# Altium schematic sheet STM32WL_RF.SchDoc
size A4; SheetNumber: 2; SheetTotal: 5
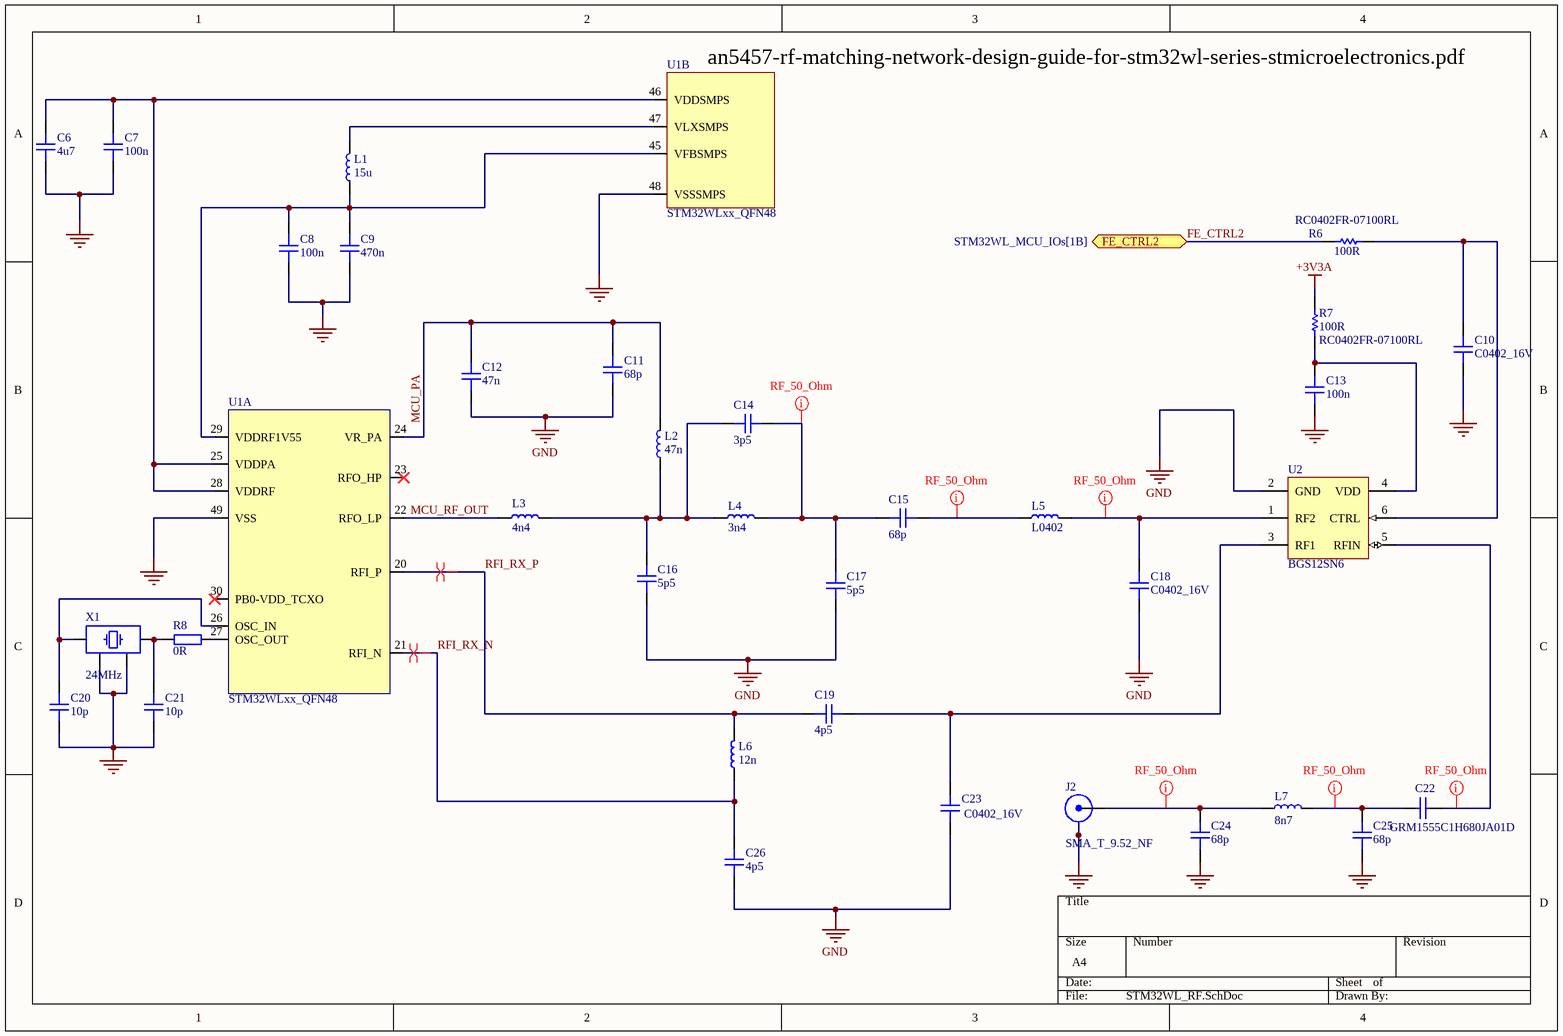
[diagram p0: STM32WL_RF.SchDoc]

## Parts
C6  4u7  [CAP_0603]
C7  100n  [CAP_0603]
C8  100n  [CAP_0603]
C9  470n  [CAP_0603]
C10  C0402_16V  [CAP_0402]
C11  68p  [CAP_0402]
C12  47n  [CAP_0402]
C13  100n  [CAP_0402]
C14  3p5  [CAP_0402]
C15  68p  [CAP_0402]
C16  5p5  [CAP_0402]
C17  5p5  [CAP_0402]
C18  C0402_16V  [CAP_0402]
C19  4p5  [CAP_0402]
C20  10p  [CAP_0402]
C21  10p  [CAP_0402]
C22  GRM1555C1H680JA01D  [CAPC1005X55X25LL05T10]
C23  C0402_16V  [CAP_0402]
C24  68p  [CAP_0402]
C25  68p  [CAP_0402]
C26  4p5  [CAP_0402]
J2  SMA_T_9.52_NF  [CO_SAMTEC_SMA-J-P-ST-EMI]
L1  15u  [IND_0402]
L2  47n  [IND_0402]
L3  4n4  [IND_0402]
L4  3n4  [IND_0402]
L5  L0402  [IND_0402]
L6  12n  [IND_0402]
L7  8n7  [IND_0402]
R6  value 100R  Manufacturer_Part_Number: RC0402FR-07100RL  [R0402]
R7  value 100R  Manufacturer_Part_Number: RC0402FR-07100RL  [R0402]
R8  0R  [RES_0402]
U1  STM32WLxx_QFN48  [STM32WLxx_QFN48]  (parts A,B of 5)
U2  BGS12SN6  [INF-TSNP-6-2_V]
X1  24MHz  [XTAL_3225]

## Ports
FE_CTRL2 (bidir, see STM32WL_MCU_IOs[1B])

## Nets
+3V3A: R7.2
GND: C6.1 C7.1 C8.1 C9.1 C10.1 C11.1 C12.1 C13.1 C16.1 C17.1 C18.1 C20.1 C21.1 C23.1 C24.1 C25.1 C26.1 J2.2(Y) U1.48(VSSSMPS) U1.49(VSS) U2.2(GND) X1.2 X1.4
FE_CTRL2: R6.1 ; port FE_CTRL2
MCU_PA: C11.2 C12.2 L2.2 U1.24(VR_PA)
MCU_RF_OUT: L3.1 U1.22(RFO_LP)
RFI_RX_N: C26.2 L6.1 U1.21(RFI_N)
RFI_RX_P: C19.1 L6.2 U1.20(RFI_P)
NetC6_2: C6.2 C7.2 U1.25(VDDPA) U1.28(VDDRF) U1.46(VDDSMPS)
NetC8_2: C8.2 C9.2 L1.1 U1.29(VDDRF1V55) U1.45(VFBSMPS)
NetC10_2: C10.2 R6.2 U2.6(CTRL)
NetC13_2: C13.2 R7.1 U2.4(VDD)
NetC14_1: C14.1 C16.2 L2.1 L3.2 L4.1
NetC14_2: C14.2 C15.1 C17.2 L4.2
NetC15_2: C15.2 L5.1
NetC18_2: C18.2 L5.2 U2.1(RF2)
NetC19_2: C19.2 C23.2 U2.3(RF1)
NetC20_2: C20.2 U1.26(OSC_IN) X1.1
NetC21_2: C21.2 R8.1 X1.3
NetC22_1: C22.1 C25.2 L7.2
NetC22_2: C22.2 U2.5(RFIN)
NetC24_2: C24.2 J2.1(X) L7.1
NetL1_2: L1.2 U1.47(VLXSMPS)
NetR8_2: R8.2 U1.27(OSC_OUT)

Not connected (* = marked no-connect by the designer): U1 23(RFO_HP)* 30(PB0-VDD_TCXO)*

## Layout directives
net class RF_50_Ohm: NetC14_2, NetC15_2, NetC18_2, NetC22_1, NetC22_2, NetC24_2
differential pair: RFI_RX_N, RFI_RX_P

## Notes on the sheet
- (near U1) an5457-rf-matching-network-design-guide-for-stm32wl-series-stmicroelectronics.pdf

## Library data of the parts
C6-C9 = CAP_0201_16V: Capacitor SMD 0201 16V
C10-C21 C23-C25 = CAP_0402_16V: Capacitor SMD 0402 16V
C22 = CMP-2008-04406-1: Manufacturer: Murata; Part Number: GRM1555C1H680JA01D
C26 = CAP_0402_16V
J2 = SMA_T_9.52_NF: SMA End Launch Jack 1.0 mm Board, 50 ohm; Manufacturer: COAX CONNECTORS LTD; Manufacturer_Part_Number: 30-462-D3-1.1mm
L1 L2 L4-L7 = IND_0402: Inductor SMD 0402
L3 = IND_0402: Inductor SMD 0402 LQW15AN4N4G80D
R6 R7 = MCD-00119: Resistor,100R,0402,1%,1/16W; Manufacturer: YAGEO; Provided_By: SUBCO; ECCN_US: EAR99; ECCN_EU: NEC; Internal_Part_Number: MCD-00119; Status: Released; Part_Type: Resistor; Package: R0402; ComponentLink1Description: Datasheet; ComponentLink1URL: http://tunmcdsvn.tun.st.com/Component_Datasheet_Library/Trunk/Resistors/Yageo_Resistor_RC0402-series
R8 = RES_0402: Resistor SMD 0402
U1 = STM32WLxx_QFN48: HQDC : Verified April, 25 2019; Manufacturer: STMicroelectronics; Manufacturer_Part_Number: STM32WLE5CC
U2 = CMP-1088-00016-1: Wideband RF SPDT Switch, 0.1 to 6 GHz, TSNP-6, Reel, Green; Manufacturer: Infineon; Green: TRUE; Supply Voltage Range: 1.8 - 3.5; Packing: Tape and Reel; Isolation @1GHz: 40 dB; Insertion Loss @1GHz: 0.25 dB; Pmax: 30 dBm; ComponentLink2URL: http://www.infineon.com/dgdl/BGS12SN6_2014-05-23.pdf?folderId=db3a30431f848401011fcbf2ab4c04c4&fileId=db3a30433f1b26e8013f2db58bc03856; PackageReference: TSNP-6-2; PartNumber: BGS12SN6; DatasheetVersion: Rev. 1.2; ComponentLink3URL: http://www.infineon.com/dgdl/TSNP-6-2-Package_Overview.pdf?folderId=db3a304327b89750012805e1379a6124&fileId=db3a30433c6612b1013c6bcb02293ba1; ComponentLink2Description: Datasheet; PackageDescription: 6-Pin Thin Small Non Leaded Package, 1.1 x 0.7 mm Body, 0.4 mm Pitch; ComponentLink1URL: http://www.infineon.com/; Frequency ( f ) Range: 0.1 to 6 GHz; Switch Type: SPDT; Mounting Technology: Surface Mount; Halogen-free: TRUE; PackageVersion: Jan-13; ComponentLink3Description: Package Specification; ComponentLink1Description: Manufacturer URL
X1 = TSX-3225_24.0000MF15X-AC: Crystal SMD 24MHz 10PPM 7pF 3225; Manufacturer: Epson; Manufacturer Number: TSX-3225 24.0000MF15X-AC; ESR: 40R; Value: 24MHz; Type: XTAL; Load Capacitance: 7pF